# Altium schematic sheet Storage_Comms.SchDoc
size A; SheetNumber: 4; SheetTotal: 4
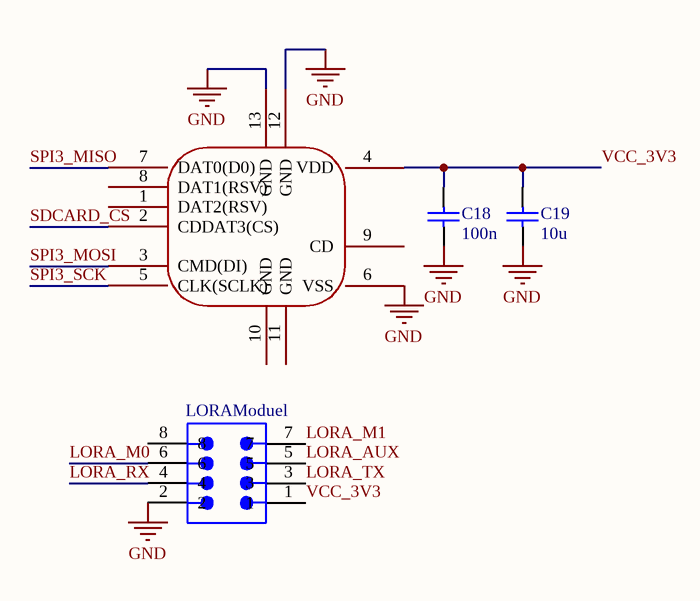
[diagram p0: Storage_Comms.SchDoc]

## Parts
C18  value 100n  (hidden comment: Capacitor)
C19  value 10u  (hidden comment: Capacitor)
CARD?  TF-01A  [TF-SMD_TF-01A]  (value not drawn)
LORAModuel  (no value)  [SMTC-MTSW-104-12-X-D-006]

## Nets
GND: C18.1 C19.1 CARD?.6(VSS) CARD?.12(GND) CARD?.13(GND) LORAModuel.2
LORA_AUX: LORAModuel.5
LORA_M0: LORAModuel.6
LORA_M1: LORAModuel.7
LORA_RX: LORAModuel.4
LORA_TX: LORAModuel.3
SDCARD_CS: CARD?.2(CDDAT3(CS))
SPI3_MISO: CARD?.7(DAT0(D0))
SPI3_MOSI: CARD?.3(CMD(DI))
SPI3_SCK: CARD?.5(CLK(SCLK))
VCC_3V3: C18.2 C19.2 CARD?.4(VDD) LORAModuel.1

Not connected (* = marked no-connect by the designer): CARD? 1(DAT2(RSV)) 8(DAT1(RSV)) 9(CD) 10(GND) 11(GND); LORAModuel 8

## Library data of the parts
C18 C19 = Capacitor: SimulationGenericComponent: True
CARD? = TF-01A_C91145: Manufacturer: 韩国韩荣; Add into BOM: yes; Card Connection Mode: Push-Push; Card Type: MicroSD Card (TF Card); Connector Type: Connector and Ejector; Supplementary Features: With Locating Post; Symbol: TF-01A; Device: TF-01A_C91145; LCSC Part Name: 自弹式 MicroSD卡(TF卡) 卡座; Supplier Part: C91145; Manufacturer Part: TF-01A; Supplier Footprint: SMD; JLCPCB Part Class: Extended Part; Datasheet: https://item.szlcsc.com/datasheet/TF-01A/92334.html; Supplier: LCSC; Convert to PCB: yes; Additional Card Detection Pins: -; Height Above Board: 1.85mm; Operating Temperature: -
LORAModuel = CMP-1024-00110-1: Modified .025" SQ Post Header, Through-hole, Vertical, -55 to 105 degC, 2.54 mm Pitch, 8-Pin, Male, RoHS; PartNumber: MTSW-104-12-T-D-006; Manufacturer: Samtec; Pitch: 2.54 mm; ComponentLink3URL: http://www.samtec.com/documents/webfiles/cpdf/MTSW-XXX-XX-X-X-XXXX-XX-XXX-MKT1.pdf; Temperature Range: -55 to 105 degC; Orientation: Vertical; ComponentLink1URL: http://www.samtec.com; PackageDescription: Assembly .025" [.64] SQ Post Terminal Strip; ComponentLink3Description: Package Specification; ComponentLink2URL: http://www.samtec.com/documents/webfiles/pdf/MTSW.PDF; ComponentLink2Description: Datasheet; PackageReference: MTSW-104-12-X-D-006; DatasheetVersion: F-214; Mounting Technology: Through-hole; RoHS: True; PackageVersion: BI, 2/1987; ComponentLink1Description: Manufacturer URL